# Altium schematic sheet PowerConnector.SchDoc
size A3; SheetNumber: 3; SheetTotal: 23
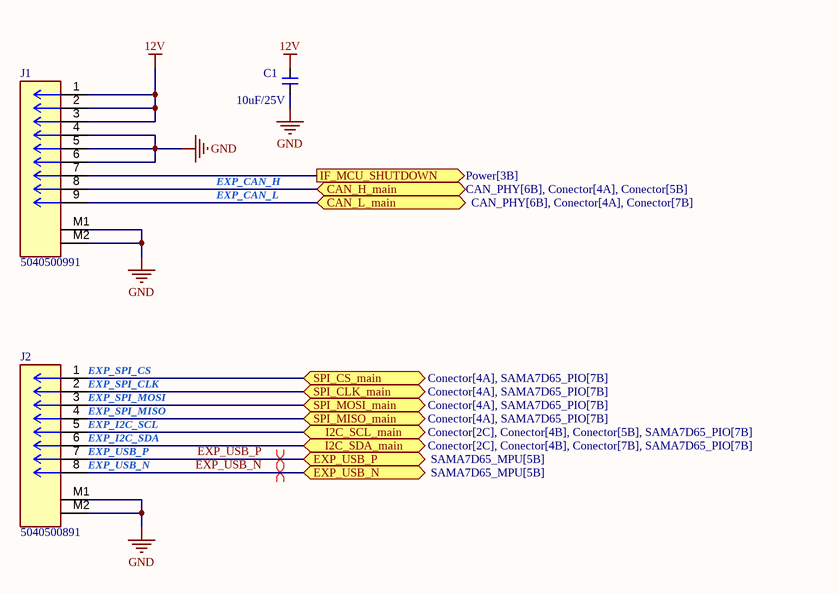
[diagram p0: PowerConnector.SchDoc]

## Parts
C1  10uF/25V  [CAP_C_1005X60]
J1  5040500991  [MOLEX_5040500991]
J2  5040500891  [MOLEX_5040500891]

## Ports
CAN_H_main (bidir, see CAN_PHY[6B], Conector[4A], Conector[5B]), CAN_L_main (bidir, see CAN_PHY[6B], Conector[4A], Conector[7B]), EXP_USB_N (bidir, see SAMA7D65_MPU[5B]), EXP_USB_P (bidir, see SAMA7D65_MPU[5B]), I2C_SCL_main (bidir, see Conector[2C], Conector[4B], Conector[5B], SAMA7D65_PIO[7B]), I2C_SDA_main (bidir, see Conector[2C], Conector[4B], Conector[7B], SAMA7D65_PIO[7B]), IF_MCU_SHUTDOWN (out, see Power[3B]), SPI_CLK_main (bidir, see Conector[4A], SAMA7D65_PIO[7B]), SPI_CS_main (bidir, see Conector[4A], SAMA7D65_PIO[7B]), SPI_MISO_main (bidir, see Conector[4A], SAMA7D65_PIO[7B]), SPI_MOSI_main (bidir, see Conector[4A], SAMA7D65_PIO[7B])

## Nets
12V: C1.2 J1.1 J1.2 J1.3
GND: C1.1 J1.4 J1.5 J1.6 J1.M1 J1.M2 J2.M1 J2.M2
CAN_H_main: J1.8 ; port CAN_H_main
CAN_L_main: J1.9 ; port CAN_L_main
EXP_USB_N: J2.8 ; port EXP_USB_N
EXP_USB_P: J2.7 ; port EXP_USB_P
I2C_SCL_main: J2.5 ; port I2C_SCL_main
I2C_SDA_main: J2.6 ; port I2C_SDA_main
IF_MCU_SHUTDOWN: J1.7 ; port IF_MCU_SHUTDOWN
SPI_CLK_main: J2.2 ; port SPI_CLK_main
SPI_CS_main: J2.1 ; port SPI_CS_main
SPI_MISO_main: J2.4 ; port SPI_MISO_main
SPI_MOSI_main: J2.3 ; port SPI_MOSI_main

## Layout directives
differential pair: EXP_USB_N, EXP_USB_P

## Notes on the sheet
- EXP_CAN_H
- EXP_CAN_L
- (near J2) EXP_SPI_CS
- (near J2) EXP_SPI_CLK
- (near J2) EXP_SPI_MOSI
- (near J2) EXP_SPI_MISO
- (near J2) EXP_I2C_SCL
- (near J2) EXP_I2C_SDA
- (near J2) EXP_USB_P
- (near J2) EXP_USB_N
- Project:
- Page Contents:
- Revision:
- Design:
- Date:
- Size:
- A3
- Document Number:
- Sheet:
- of

## Library data of the parts
C1 = _CAP_C_2: CAP CHIP
J1 = 5040500991: Connector Header Surface Mount, Right Angle 9 position 0.059" (1.50mm)
J2 = 5040500891: Connector Header Surface Mount, Right Angle 8 position 0.059" (1.50mm)`